# Altium schematic sheet STM32.SchDoc: STM32
size A3; Author: Orhun DABAK; DrawnBy: Orhun DABAK; Revision: 1.0; SheetNumber: 1; SheetTotal: 3
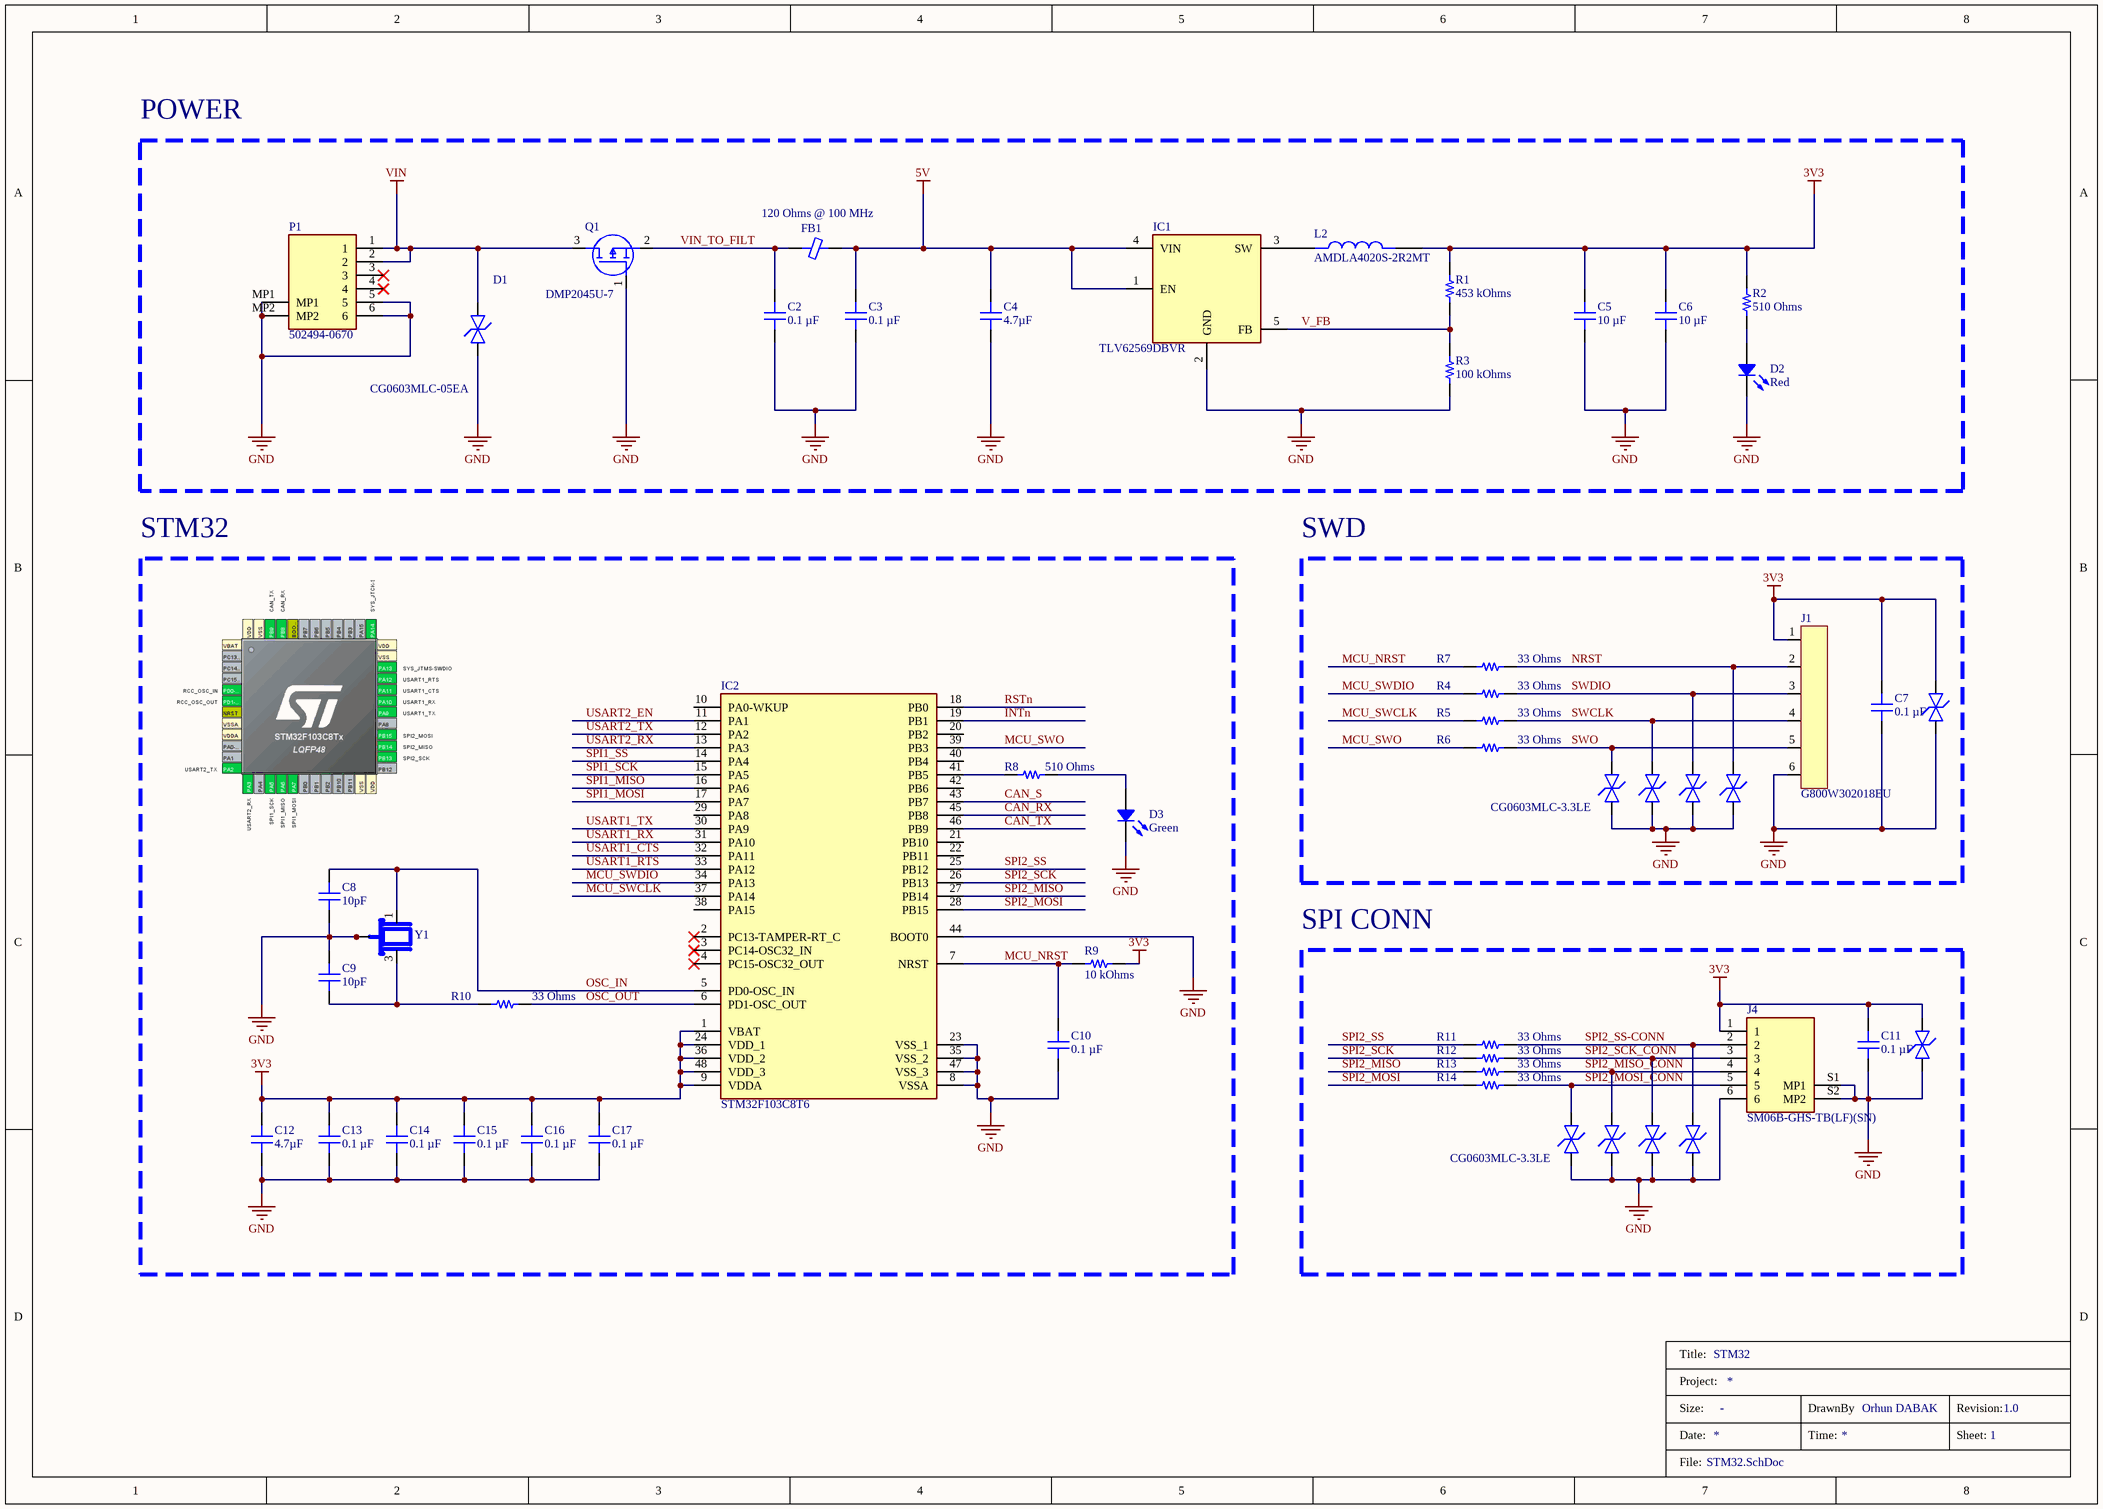
[diagram p0: STM32.SchDoc]

## Parts
*  Title_Block  (value not drawn)  (graphical)
C2  0.1 µF  [CAP 0603_1608]
C3  0.1 µF  [CAP 0603_1608]
C4  4.7µF  [CAP 0805_2012]
C5  10 µF  [CAP 0805_2012]
C6  10 µF  [CAP 0805_2012]
C7  0.1 µF  [CAP 0603_1608]
C8  10pF  [CAP 0603_1608]
C9  10pF  [CAP 0603_1608]
C10  0.1 µF  [CAP 0603_1608]
C11  0.1 µF  [CAP 0603_1608]
C12  4.7µF  [CAP 0805_2012]
C13  0.1 µF  [CAP 0603_1608]
C14  0.1 µF  [CAP 0603_1608]
C15  0.1 µF  [CAP 0603_1608]
C16  0.1 µF  [CAP 0603_1608]
C17  0.1 µF  [CAP 0603_1608]
D1  CG0603MLC-05EA  [DIONC1608X55N]
D2  Red  [LED 0603_1608 RED]
D3  Green  [LED 0603_1608 GREEN]
FB1  120 Ohms @ 100 MHz  [FER 0603_1608]
IC1  TLV62569DBVR  [SOT95P280X145-5N]
IC2  STM32F103C8T6  [QFP50P900X900X160-48N]
J1  G800W302018EU  [G800W302018EU]
J4  SM06B-GHS-TB(LF)(SN)  [JST_SM06B-GHS-TB(LF)(SN)]
L2  AMDLA4020S-2R2MT  [IND_AMDLA4020S-2R2MT]
P1  502494-0670  [MOLEX_502494-0670]
Q1  DMP2045U-7  [SOT96P240X110-3N]
R1  453 kOhms  [RES 0603_1608]
R2  510 Ohms  [RES 0603_1608]
R3  100 kOhms  [RES 0603_1608]
R4  33 Ohms  [RES 0603_1608]
R5  33 Ohms  [RES 0603_1608]
R6  33 Ohms  [RES 0603_1608]
R7  33 Ohms  [RES 0603_1608]
R8  510 Ohms  [RES 0603_1608]
R9  10 kOhms  [RES 0603_1608]
R10  33 Ohms  [RES 0603_1608]
R11  33 Ohms  [RES 0603_1608]
R12  33 Ohms  [RES 0603_1608]
R13  33 Ohms  [RES 0603_1608]
R14  33 Ohms  [RES 0603_1608]
RV1  CG0603MLC-3.3LE  [VARC1608X55N]  (value not drawn)
RV2  CG0603MLC-3.3LE  [VARC1608X55N]
RV3  CG0603MLC-3.3LE  [VARC1608X55N]  (value not drawn)
RV4  CG0603MLC-3.3LE  [VARC1608X55N]  (value not drawn)
RV5  CG0603MLC-3.3LE  [VARC1608X55N]  (value not drawn)
RV6  CG0603MLC-3.3LE  [VARC1608X55N]  (value not drawn)
RV7  CG0603MLC-3.3LE  [VARC1608X55N]
RV8  CG0603MLC-3.3LE  [VARC1608X55N]  (value not drawn)
RV9  CG0603MLC-3.3LE  [VARC1608X55N]  (value not drawn)
RV10  CG0603MLC-3.3LE  [VARC1608X55N]  (value not drawn)
Y1  X322516MLB4SI  [X322516MLB4SI]  (value not drawn)

## Blocks framed on the sheet
POWER: C2-C6 D1 D2 FB1 IC1 L2 P1 Q1 R1-R3
STM32: C8-C10 C12-C17 D3 IC2 R8-R10 Y1
SWD: C7 J1 R4-R7 RV1-RV5
SPI CONN: C11 J4 R11-R14 RV6-RV10

## Nets
3V3: C5.2 C6.2 C7.1 C11.2 C12.2 C13.1 C14.1 C15.1 C16.1 C17.1 IC2.1(VBAT) IC2.9(VDDA) IC2.24(VDD_1) IC2.36(VDD_2) IC2.48(VDD_3) J1.1 J4.1 L2.2 R1.2 R2.2 R9.1 RV1.2 RV6.2
5V: C3.2 C4.2 FB1.2 IC1.1(EN) IC1.4(VIN)
GND: C2.1 C3.1 C4.1 C5.1 C6.1 C7.2 C8.1 C9.1 C10.2 C11.1 C12.1 C13.2 C14.2 C15.2 C16.2 C17.2 D1.1 D2.2 D3.2 IC1.2(GND) IC2.8(VSSA) IC2.23(VSS_1) IC2.35(VSS_2) IC2.44(BOOT0) IC2.47(VSS_3) J1.6 J4.6 J4.S1(MP1) J4.S2(MP2) P1.5 P1.6 P1.MP1 P1.MP2 Q1.1(G) R3.2 RV1.1 RV2.1 RV3.1 RV4.1 RV5.1 RV6.1 RV7.1 RV8.1 RV9.1 RV10.1 Y1.2(GND) Y1.4(GND)
VIN: D1.2 P1.1 P1.2 Q1.3(D)
CAN_RX: IC2.45(PB8)
CAN_S: IC2.43(PB7)
CAN_TX: IC2.46(PB9)
INTn: IC2.19(PB1)
MCU_NRST: C10.1 IC2.7(NRST) R7.1 R9.2
MCU_SWCLK: IC2.37(PA14) R5.1
MCU_SWDIO: IC2.34(PA13) R4.1
MCU_SWO: IC2.39(PB3) R6.1
NRST: J1.2 R7.2 RV2.2
OSC_IN: C8.2 IC2.5(PD0-OSC_IN) Y1.1
OSC_OUT: IC2.6(PD1-OSC_OUT) R10.2
RSTn: IC2.18(PB0)
SPI1_MISO: IC2.16(PA6)
SPI1_MOSI: IC2.17(PA7)
SPI1_SCK: IC2.15(PA5)
SPI1_SS: IC2.14(PA4)
SPI2_MISO: IC2.27(PB14) R13.1
SPI2_MISO_CONN: J4.4 R13.2 RV8.2
SPI2_MOSI: IC2.28(PB15) R14.1
SPI2_MOSI_CONN: J4.5 R14.2 RV7.2
SPI2_SCK: IC2.26(PB13) R12.1
SPI2_SCK_CONN: J4.3 R12.2 RV9.2
SPI2_SS: IC2.25(PB12) R11.1
SPI2_SS-CONN: J4.2 R11.2 RV10.2
SWCLK: J1.4 R5.2 RV4.2
SWDIO: J1.3 R4.2 RV5.2
SWO: J1.5 R6.2 RV3.2
USART1_CTS: IC2.32(PA11)
USART1_RTS: IC2.33(PA12)
USART1_RX: IC2.31(PA10)
USART1_TX: IC2.30(PA9)
USART2_EN: IC2.11(PA1)
USART2_RX: IC2.13(PA3)
USART2_TX: IC2.12(PA2)
V_FB: IC1.5(FB) R1.1 R3.1
VIN_TO_FILT: C2.2 FB1.1 Q1.2(S)
NetC9_2: C9.2 R10.1 Y1.3
NetD2_1: D2.1 R2.1
NetD3_1: D3.1 R8.1
NetIC1_3: IC1.3(SW) L2.1
NetIC2_41: IC2.41(PB5) R8.2

Not connected (* = marked no-connect by the designer): IC2 2(PC13-TAMPER-RT_C)* 3(PC14-OSC32_IN)* 4(PC15-OSC32_OUT)* 10(PA0-WKUP) 20(PB2) 21(PB10) 22(PB11) 29(PA8) 38(PA15) 40(PB4) 42(PB6); P1 3* 4*

## Notes on the sheet
- (in symbol Title_Block) Title:; Project:; Size:; DrawnBy; Revision:; Date:; Time:; Sheet:; File:

## Library data of the parts
* = Title_Block: Standart Title Block; Size: -
C2 C3 C7 C10 C11 C13-C17 = CS0603KRX7R7BB104: CAP CER 0.1UF 16V X7R 0603; manufacturer: Yageo; Tolerance: ±10%; Part Number: CS0603KRX7R7BB104; Value: 0.1 µF; Applications: Boardflex Sensitive; Capacitance: 0.1 µF; componentlink1description: Datasheet; componentlink1url: http://www.yageo.com/NewPortal/yageodocoutput?fileName=/pdf/MLCC/UPY-ST_NPOX7R_16V-to-3KV_5.pdf; componentlink2description: DigiKey Link; componentlink2url: https://www.digikey.com/en/products/detail/yageo/CS0603KRX7R7BB104/6097897; Device Package: 0603 (1608 Metric); Features: Soft Termination; lastupdated: 3/3/2023 08:08:52 PM; Lifecycle Status: Active; Minimum Order: 1; Mounting Type: Surface Mount, MLCC; Operating Temperature: -55°C ~ 125°C; Package / Case: 0603 (1608 Metric); packaging: TapeAndReel; partid: 2286; Part Status: Active; price: 0.01; series: CS; Size / Dimension: 0.063" L x 0.031" W (1.60mm x 0.80mm); Supplier 1: DigiKey; Supplier Part Number 1: 311-3560-1-ND; Temperature Coefficient: X7R; Thickness (Max): 0.037" (0.95mm); Voltage - Rated: 16V
C4 C12 = 0805YC475MAT2A: CAP CER 4.7UF 16V X7R 0805; manufacturer: AVX Corporation; Tolerance: ±20%; Part Number: 0805YC475MAT2A; Value: 4.7µF; Applications: General Purpose; Capacitance: 4.7µF; componentlink1description: Datasheet; componentlink1url: http://datasheets.avx.com/X7RDielectric.pdf; componentlink2description: DigiKey Link; componentlink2url: http://digikey.com/product-detail/en/avx-corporation/0805YC475MAT2A/478-10575-1-ND/6797621; Device Package: 0805 (2012 Metric); lastupdated: 9/2/2020 01:04:40 AM; Lifecycle Status: Active; Minimum Order: 1; Mounting Type: Surface Mount, MLCC; Operating Temperature: -55°C ~ 125°C; Package / Case: 0805 (2012 Metric); packaging: TapeAndReel; partid: 3443; Part Status: Active; price: 0.12; series: -; Size / Dimension: 0.079" L x 0.049" W (2.01mm x 1.25mm); Supplier 1: DigiKey; Supplier Part Number 1: 478-10575-1-ND; Temperature Coefficient: X7R; Thickness (Max): 0.060" (1.52mm); Voltage - Rated: 16V
C5 C6 = C2012X6S1C106K125AC: CAP CER 10UF 16V X6S 0805; manufacturer: TDK Corporation; Tolerance: ±10%; Part Number: C2012X6S1C106K125AC; Value: 10 µF; Applications: General Purpose; Capacitance: 10 µF; componentlink1description: Datasheet; componentlink1url: https://product.tdk.com/info/en/catalog/datasheets/mlcc_commercial_general_en.pdf?ref_disty=digikey; componentlink2description: DigiKey Link; componentlink2url: https://www.digikey.com/en/products/detail/tdk-corporation/C2012X6S1C106K125AC/2733046; Device Package: 0805 (2012 Metric); Features: Low ESL; lastupdated: 3/3/2023 08:12:18 PM; Lifecycle Status: Active; Minimum Order: 1; Mounting Type: Surface Mount, MLCC; Operating Temperature: -55°C ~ 105°C; Package / Case: 0805 (2012 Metric); packaging: TapeAndReel; partid: 2995; Part Status: Active; price: 0.07; series: C; Size / Dimension: 0.079" L x 0.049" W (2.00mm x 1.25mm); Supplier 1: DigiKey; Supplier Part Number 1: 445-7611-1-ND; Temperature Coefficient: X6S; Thickness (Max): 0.057" (1.45mm); Voltage - Rated: 16V
C8 C9 = 06035A100J4T2A: CAP CER 10PF 50V NP0 0603; manufacturer: AVX Corporation; Temperature Coefficient: C0G, NP0; Tolerance: ±5%; Part Number: 06035A100J4T2A; Value: 10pF; Applications: Automotive; Capacitance: 10pF; componentlink1description: Datasheet; componentlink1url: http://datasheets.avx.com/AutoMLCC.pdf; componentlink2description: DigiKey Link; componentlink2url: http://digikey.com/product-detail/en/avx-corporation/06035A100J4T2A/478-11607-1-ND/8564165; Device Package: 0603 (1608 Metric); lastupdated: 9/2/2020 01:03:34 AM; Lifecycle Status: Active; Minimum Order: 1; Mounting Type: Surface Mount, MLCC; Operating Temperature: -55°C ~ 125°C; Package / Case: 0603 (1608 Metric); packaging: TapeAndReel; partid: 3073; Part Status: Active; price: 0.04; Ratings: AEC-Q200; series: -; Size / Dimension: 0.063" L x 0.031" W (1.60mm x 0.80mm); Supplier 1: DigiKey; Supplier Part Number 1: 478-11607-1-ND; Thickness (Max): 0.035" (0.90mm); Voltage - Rated: 50V
D1 = CG0603MLC-05EA: TVS Diode (Bi-directional); Manufacturer_Name: Bourns; Datasheet Link: https://datasheet.datasheetarchive.com/originals/dk/DKDS-12/224862.pdf; Height: 0.55mm; Manufacturer_Part_Number: CG0603MLC-05EA
D2 = LTST-C193KRKT-2A: LED RED CLEAR CHIP SMD; Manufacturer: Lite-On Inc.; Configuration: Standard; Current - Test: 2mA; Lens Color: Colorless; Lens Size: 1.15mm x 0.80mm; Lens Style: Rectangle with Flat Top; Millicandela Rating: 6.5mcd; Viewing Angle: 130°; Voltage - Forward (Vf) (Typ): 1.9V; Wavelength - Dominant: 629nm; Wavelength - Peak: 639nm; Part Number: LTST-C193KRKT-2A; Color: Red; ComponentLink1Description: Datasheet; ComponentLink1URL: //media.digikey.com/pdf/Data%20Sheets/Lite-On%20PDFs/LTST-C193KRKT-2A.pdf; ComponentLink2Description: DigiKey Link; ComponentLink2URL: http://digikey.com/product-detail/en/lite-on-inc/LTST-C193KRKT-2A/160-1909-1-ND/3694456; Device Package: 0603 (1608 Metric); Height (Max): 0.35mm; LastUpdated: 3/3/2023 08:56:33 PM; Lens Transparency: Clear; Lifecycle Status: Active; Minimum Order: 1; Mounting Type: Surface Mount; Package / Case: 0603 (1608 Metric); Packaging: TapeAndReel; PartId: 382; Part Status: Active; Price: 0.07; Series: -; Size / Dimension: 1.60mm L x 0.80mm W; Supplier 1: DigiKey; Supplier Part Number 1: 160-1909-1-ND; Supplier Device Package: Chip LED; Value: Red
D3 = LSM0603453V: LED SM 0603 3V -/1000/-MCD GREEN; Manufacturer: Visual Communications Company - VCC; Configuration: Standard; Current - Test: 20mA; Lens Color: Colorless; Lens Size: 1.20mm x 0.80mm; Lens Style: Rectangle with Flat Top; Lens Transparency: Clear; Millicandela Rating: 63mcd; Viewing Angle: 120°; Voltage - Forward (Vf) (Typ): 2V; Wavelength - Dominant: 572nm; Wavelength - Peak: 571nm; Part Number: LSM0603453V; Color: Green; ComponentLink1Description: Datasheet; ComponentLink1URL: https://vcclite.com/wp-content/uploads/wpallimport/files/files/LSM0603453V.pdf; ComponentLink2Description: DigiKey Link; ComponentLink2URL: https://www.digikey.com/en/products/detail/visual-communications-company-vcc/LSM0603453V/9486724; Device Package: 0603 (1608 Metric); Height (Max): 0.65mm; LastUpdated: 3/3/2023 08:56:02 PM; Lifecycle Status: Active; Minimum Order: 1; Mounting Type: Surface Mount; Package / Case: 0603 (1608 Metric); Packaging: TapeAndReel; PartId: 579; Part Status: Active; Price: 0.08; Series: LSM0603; Size / Dimension: 1.60mm L x 0.80mm W; Supplier 1: DigiKey; Supplier Part Number 1: LSM0603453VCT-ND; Supplier Device Package: Chip LED; Value: Green
FB1 = 742792625: FERRITE BEAD 120 OHM 0603 1LN; Manufacturer: Würth Elektronik; Current Rating (Max): 2A; DC Resistance (DCR) (Max): 50mOhm; Filter Type: Signal Line; Number of Lines: 1; Part Number: 742792625; ComponentLink1Description: Datasheet; ComponentLink1URL: https://katalog.we-online.de/pbs/datasheet/742792625.pdf; ComponentLink2Description: DigiKey Link; ComponentLink2URL: https://www.digikey.com/en/products/detail/würth-elektronik/742792625/4310426; Device Package: 0603 (1608 Metric); Height (Max): 0.039" (1.00mm); Impedance @ Frequency: 120 Ohms @ 100 MHz; LastUpdated: 3/3/2023 08:50:24 PM; Lifecycle Status: Active; Minimum Order: 1; Mounting Type: Surface Mount; Operating Temperature: -55°C ~ 125°C; Package / Case: 0603 (1608 Metric); Packaging: TapeAndReel; PartId: 1102; Part Status: Active; Price: 0.10; Ratings: AEC-Q200; Series: WE-CBF; Size / Dimension: 0.063" L x 0.032" W (1.60mm x 0.80mm); Supplier 1: DigiKey; Supplier Part Number 1: 732-4665-1-ND; Value: 120 Ohms @ 100 MHz
IC1 = TLV62569DBVR: Integrated Circuit; Manufacturer_Name: Texas Instruments; Datasheet Link: http://www.ti.com/lit/gpn/tlv62569; Height: 1.45mm; Manufacturer_Part_Number: TLV62569DBVR; Mouser Part Number: 595-TLV62569DBVR; Mouser Price/Stock: https://www.mouser.co.uk/ProductDetail/Texas-Instruments/TLV62569DBVR?qs=0C8XhJW8e4oaylc%252BzBrCmA%3D%3D; Arrow Part Number: TLV62569DBVR; Arrow Price/Stock: https://www.arrow.com/en/products/tlv62569dbvr/texas-instruments?region=nac
IC2 = STM32F103C8T6: Integrated Circuit; Manufacturer_Name: STMicroelectronics; Datasheet Link: https://www.st.com/resource/en/datasheet/stm32f103c8.pdf; Height: 1.6mm; Manufacturer_Part_Number: stm32f103c8t6; Mouser Part Number: 511-STM32F103C8T6; Mouser Price/Stock: https://www.mouser.co.uk/ProductDetail/STMicroelectronics/STM32F103C8T6?qs=bhCVus9SdFtq6kqxsU5%2FDA%3D%3D; Arrow Part Number: STM32F103C8T6; Arrow Price/Stock: https://www.arrow.com/en/products/stm32f103c8t6/stmicroelectronics?region=nac
J1 = G800W302018EU: Pin Header 6 Position 2.54mm Pitch; Manufacturer: Amphenol; Manufacturer Part Number: G800W302018EU
J4 = SM06B-GHS-TB(LF)(SN): ÐŸÐ¾Ð²ÐµÑ€Ñ…Ð½Ð¾ÑÑ‚Ð½Ñ‹Ð¹ Ð¼Ð¾Ð½Ñ‚Ð°Ð¶ Ñ€Ð°Ð·ÑŠÐµÐ¼Ð°, Ð¿Ñ€ÑÐ¼Ð¾Ð¹ ÑƒÐ³Ð¾Ð» 6, Ð¿Ð¾Ð»Ð¾Ð¶ÐµÐ½Ð¸Ðµ 0,049 _1,25 Ð¼Ð¼_; MP: SM06B-GHS-TB_LF__SN_; MF: JST Sales; Value: *; Package: None; Price: None; Availability: Unavailable; SnapEDA_Link: https://www.snapeda.com/parts/SM06B-GHS-TB%28LF%29%28SN%29/JST%20Sales%20America%20Inc./view-part/817690/?ref=snap
L2 = AMDLA4020S-2R2MT: Power Inductor (SMD), 2.2 uH, Â± 20%, 4.5 A, Shielded, 6 A, 4.4mm x 4mm x 1.8mm; MF: Abracon Corporation; Purchase-URL: https://pricing.snapeda.com/search/part/AMDLA4020S-2R2MT/?ref=eda; Package: Package; MP: AMDLA4020S-2R2MT; Value: *; SnapEDA_Link: https://www.snapeda.com/parts/AMDLA4020S-2R2MT/Abracon/view-part/?ref=snap; Availability: In Stock; Price: None; Check_prices: https://www.snapeda.com/parts/AMDLA4020S-2R2MT/Abracon/view-part/?ref=eda
P1 = 502494-0670: 2.00mm Pitch CLIK-Mateâ„¢ Wire-to-Board PCB Receptacle, Single Row, Right Angle, 6 Circuits; Package: None; Price: None; Value: *; MP: 502494-0670; Availability: Unavailable
Q1 = DMP2045U-7: MOSFET (P-Channel); Manufacturer_Name: Diodes Inc.; Datasheet Link: https://www.diodes.com/assets/Datasheets/DMP2045U.pdf; Height: 1.1mm; Manufacturer_Part_Number: DMP2045U-7; Mouser Part Number: 621-DMP2045U-7; Mouser Price/Stock: https://www.mouser.co.uk/ProductDetail/Diodes-Incorporated/DMP2045U-7?qs=rrS6PyfT74erdUwo5CgHTg%3D%3D; Arrow Part Number: DMP2045U-7; Arrow Price/Stock: https://www.arrow.com/en/products/dmp2045u-7/diodes-incorporated?region=nac
R1 = SDR03EZPF4533: RES SMD 453 KOHM 1% 0.3W 0603; Manufacturer: Rohm Semiconductor; Temperature Coefficient: ±100ppm/°C; Part Number: SDR03EZPF4533; Value: 453 kOhms; ComponentLink1Description: Datasheet; ComponentLink1URL: https://www.rohm.com/datasheet/SDR03EZPF/sdr-e; ComponentLink2Description: DigiKey Link; ComponentLink2URL: https://www.digikey.com/en/products/detail/rohm-semiconductor/SDR03EZPF4533/9674970; Composition: Thick Film; Device Package: 0603 (1608 Metric); Features: Pulse Withstanding; Height - Seated (Max): 0.022" (0.55mm); LastUpdated: 3/3/2023 08:29:48 PM; Lifecycle Status: Active; Minimum Order: 1; Number of Terminations: 2; Operating Temperature: -55°C ~ 155°C; Package / Case: 0603 (1608 Metric); Packaging: TapeAndReel; PartId: 5359; Part Status: Active; Power (Watts): 0.3W; Price: 0.02; Resistance: 453 kOhms; Series: SDR03; Size / Dimension: 0.063" L x 0.031" W (1.60mm x 0.80mm); Supplier 1: DigiKey; Supplier Part Number 1: 511-1720-1-ND; Supplier Device Package: 0603; Tolerance: ±1%
R2 R8 = RMCF0603JT510R: RES 510 OHM 5% 1/10W 0603; Manufacturer: Stackpole Electronics Inc; Power (Watts): 0.1W, 1/10W; Temperature Coefficient: ±200ppm/°C; Part Number: RMCF0603JT510R; Value: 510 Ohms; ComponentLink1Description: Datasheet; ComponentLink1URL: https://www.seielect.com/catalog/sei-rmcf_rmcp.pdf; ComponentLink2Description: DigiKey Link; ComponentLink2URL: https://www.digikey.com/en/products/detail/stackpole-electronics-inc/RMCF0603JT510R/1757941; Composition: Thick Film; Device Package: 0603 (1608 Metric); Features: Automotive AEC-Q200; Height - Seated (Max): 0.022" (0.55mm); LastUpdated: 3/3/2023 08:29:46 PM; Lifecycle Status: Active; Minimum Order: 1; Number of Terminations: 2; Operating Temperature: -55°C ~ 155°C; Package / Case: 0603 (1608 Metric); Packaging: CutTape; PartId: 5929; Part Status: Active; Price: 0.01; Ratings: AEC-Q200; Resistance: 510 Ohms; Series: RMCF; Size / Dimension: 0.061" L x 0.031" W (1.55mm x 0.80mm); Supplier 1: DigiKey; Supplier Part Number 1: RMCF0603JT510RCT-ND; Supplier Device Package: 0603; Tolerance: ±5%
R3 = RT0603FRE07100KL: RES SMD 100K OHM 1% 1/10W 0603; Manufacturer: Yageo; Power (Watts): 0.1W, 1/10W; Temperature Coefficient: ±50ppm/°C; Part Number: RT0603FRE07100KL; Value: 100 kOhms; ComponentLink1Description: Datasheet; ComponentLink1URL: https://www.yageo.com/upload/media/product/productsearch/datasheet/rchip/PYu-RT_1-to-0.01_RoHS_L_11.pdf; ComponentLink2Description: DigiKey Link; ComponentLink2URL: https://www.digikey.com/en/products/detail/yageo/RT0603FRE07100KL/1075029; Composition: Thin Film; Device Package: 0603 (1608 Metric); Height - Seated (Max): 0.022" (0.55mm); LastUpdated: 3/3/2023 08:29:47 PM; Lifecycle Status: Active; Minimum Order: 1; Number of Terminations: 2; Operating Temperature: -55°C ~ 155°C; Package / Case: 0603 (1608 Metric); Packaging: TapeAndReel; PartId: 5677; Part Status: Active; Price: 0.01; Resistance: 100 kOhms; Series: RT; Size / Dimension: 0.063" L x 0.031" W (1.60mm x 0.80mm); Supplier 1: DigiKey; Supplier Part Number 1: YAG2319CT-ND; Supplier Device Package: 0603; Tolerance: ±1%
R4-R7 R10-R14 = RMCF0603JT33R0: RES 33 OHM 5% 1/10W 0603; Manufacturer: Stackpole Electronics Inc; Power (Watts): 0.1W, 1/10W; Temperature Coefficient: ±200ppm/°C; Part Number: RMCF0603JT33R0; Value: 33 Ohms; ComponentLink1Description: Datasheet; ComponentLink1URL: https://www.seielect.com/catalog/sei-rmcf_rmcp.pdf; ComponentLink2Description: DigiKey Link; ComponentLink2URL: https://www.digikey.com/en/products/detail/stackpole-electronics-inc/RMCF0603JT33R0/1758048; Composition: Thick Film; Device Package: 0603 (1608 Metric); Features: Automotive AEC-Q200; Height - Seated (Max): 0.022" (0.55mm); LastUpdated: 3/3/2023 08:29:46 PM; Lifecycle Status: Active; Minimum Order: 1; Number of Terminations: 2; Operating Temperature: -55°C ~ 155°C; Package / Case: 0603 (1608 Metric); Packaging: CutTape; PartId: 5849; Part Status: Active; Price: 0.01; Ratings: AEC-Q200; Resistance: 33 Ohms; Series: RMCF; Size / Dimension: 0.061" L x 0.031" W (1.55mm x 0.80mm); Supplier 1: DigiKey; Supplier Part Number 1: RMCF0603JT33R0CT-ND; Supplier Device Package: 0603; Tolerance: ±5%
R9 = CRCW060310K0JNEA: RES SMD 10K OHM 5% 1/10W 0603; Manufacturer: Vishay Dale; Power (Watts): 0.1W, 1/10W; Temperature Coefficient: ±200ppm/°C; Part Number: CRCW060310K0JNEA; Value: 10 kOhms; ComponentLink1Description: Datasheet; ComponentLink1URL: http://www.vishay.com/docs/20035/dcrcwe3.pdf; ComponentLink2Description: DigiKey Link; ComponentLink2URL: http://digikey.com/product-detail/en/vishay-dale/CRCW060310K0JNEA/541-10KGCT-ND/1179393; Composition: Thick Film; Device Package: 0603 (1608 Metric); Features: Automotive AEC-Q200; Height - Seated (Max): 0.020" (0.50mm); LastUpdated: 3/3/2023 08:29:48 PM; Lifecycle Status: Active; Minimum Order: 1; Number of Terminations: 2; Operating Temperature: -55°C ~ 155°C; Package / Case: 0603 (1608 Metric); Packaging: CutTape; PartId: 5216; Part Status: Active; Price: 0.10; Ratings: AEC-Q200; Resistance: 10 kOhms; Series: CRCW; Size / Dimension: 0.063" L x 0.033" W (1.60mm x 0.85mm); Supplier 1: DigiKey; Supplier Part Number 1: 541-10KGCT-ND; Supplier Device Package: 0603; Tolerance: ±5%
RV1-RV10 = CG0603MLC-3.3LE: Varistor; Manufacturer_Name: Bourns; Datasheet Link: https://www.bourns.com/docs/Product-Datasheets/MLC.pdf; Height: 0.55mm; Manufacturer_Part_Number: CG0603MLC-3.3LE; Mouser Part Number: 652-CG0603MLC-3.3LE; Mouser Price/Stock: https://www.mouser.co.uk/ProductDetail/Bourns/CG0603MLC-3.3LE?qs=m8myXnDJXpXlL5%252BDNWWe1g%3D%3D; Arrow Part Number: CG0603MLC-3.3LE; Arrow Price/Stock: https://www.arrow.com/en/products/cg0603mlc-3.3le/bourns?region=nac
Y1 = X322516MLB4SI: Crystal or Oscillator; Manufacturer_Name: Yangxing Tech; Datasheet Link: https://datasheet.lcsc.com/szlcsc/Yangxing-Tech-X322516MLB4SI_C13738.pdf; Height: 0.8mm; Manufacturer_Part_Number: X322516MLB4SI